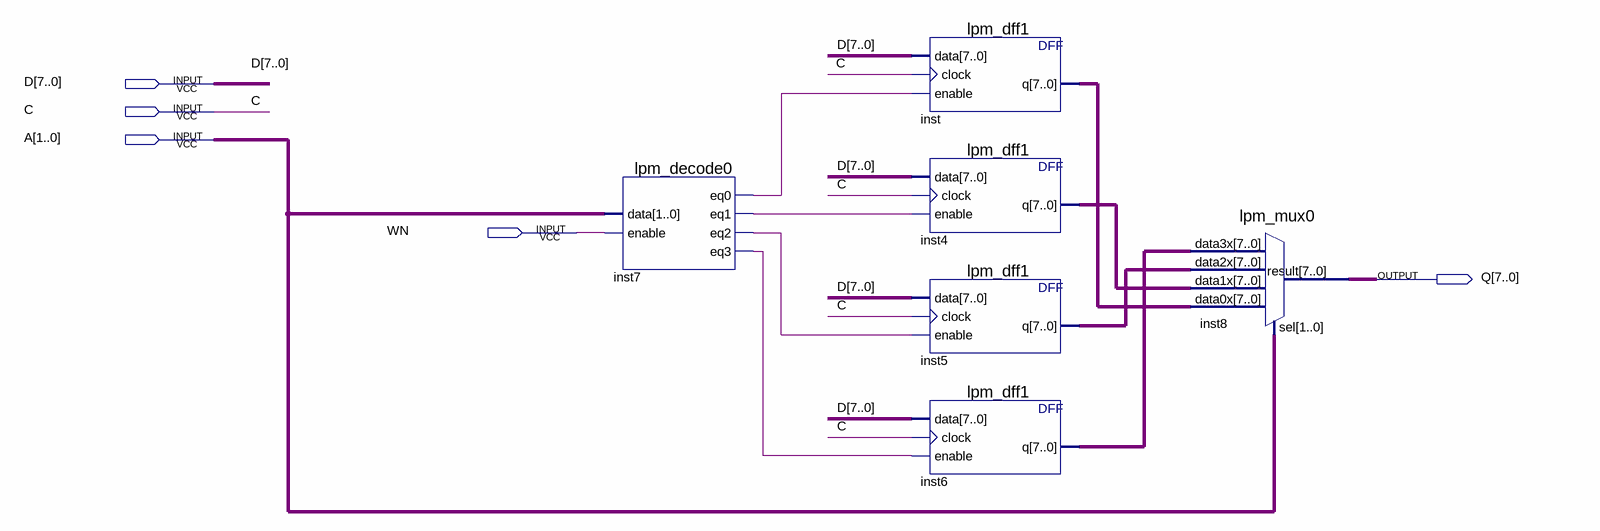
[diagram p0: schematic sheet]
// Quartus schematic Lab10.bdf as structural Verilog: 6 symbols, 5 pins
module Lab10 (
  input  [7:0] D,
  input  C,
  input  [1:0] A,
  input  WN,
  output [7:0] Q
);

  wire inst7_eq0, inst7_eq1, inst7_eq2, inst7_eq3;
  wire [7:0] inst4_q, inst5_q, inst6_q, inst_q;

  lpm_decode0 inst7 (.data(A), .enable(WN), .eq0(inst7_eq0), .eq1(inst7_eq1), .eq2(inst7_eq2), .eq3(inst7_eq3));
  lpm_dff1 inst (.data(D), .clock(C), .enable(inst7_eq0), .q(inst_q));
  lpm_dff1 inst4 (.data(D), .clock(C), .enable(inst7_eq1), .q(inst4_q));
  lpm_dff1 inst5 (.data(D), .clock(C), .enable(inst7_eq2), .q(inst5_q));
  lpm_dff1 inst6 (.data(D), .clock(C), .enable(inst7_eq3), .q(inst6_q));
  lpm_mux0 inst8 (.data3x(inst6_q), .data2x(inst5_q), .data1x(inst4_q), .data0x(inst_q), .sel(A), .result(Q));
endmodule
